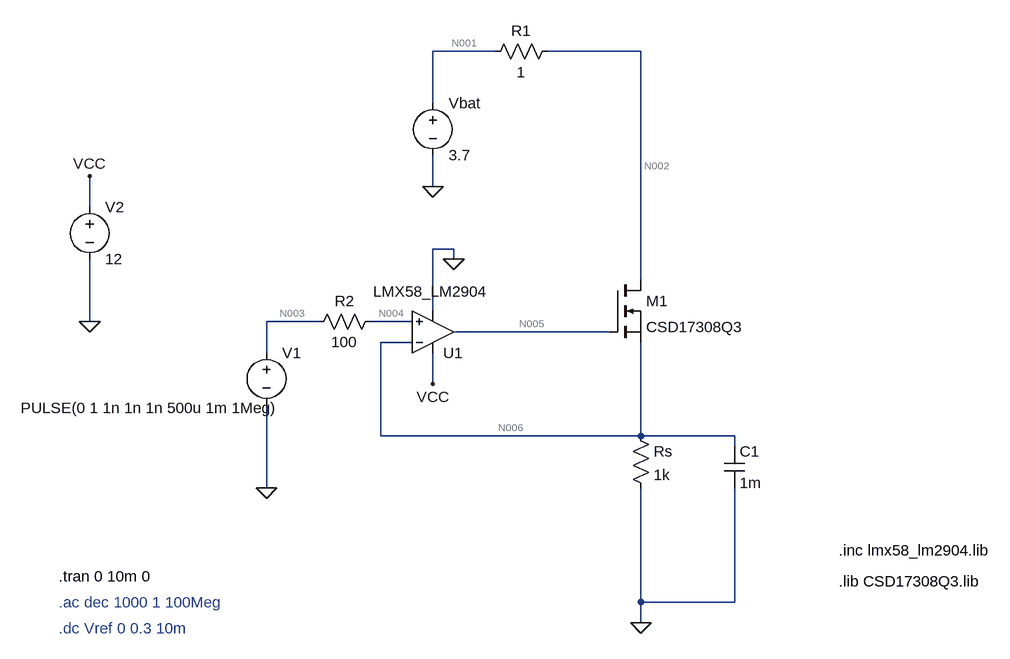
[diagram p0: schematic modulo_descarga_pwm.asc]
modulo_descarga_pwm.asc, the LTspice schematic file:
Version 4.1
SHEET 1 1700 680
WIRE 720 -912 624 -912
WIRE 944 -912 800 -912
WIRE 624 -832 624 -912
WIRE 624 -704 624 -752
WIRE 96 -672 96 -720
WIRE 656 -608 624 -608
WIRE 656 -592 656 -608
WIRE 944 -560 944 -912
WIRE 624 -512 624 -608
WIRE 96 -496 96 -592
WIRE 448 -496 368 -496
WIRE 592 -496 528 -496
WIRE 896 -480 656 -480
WIRE 592 -464 544 -464
WIRE 368 -448 368 -496
WIRE 624 -400 624 -448
WIRE 544 -320 544 -464
WIRE 944 -320 944 -464
WIRE 944 -320 544 -320
WIRE 1088 -320 944 -320
WIRE 1088 -304 1088 -320
WIRE 368 -240 368 -368
WIRE 944 -64 944 -240
WIRE 1088 -64 1088 -240
WIRE 1088 -64 944 -64
WIRE 944 -32 944 -64
FLAG 944 -32 0
FLAG 96 -720 VCC
FLAG 96 -496 0
FLAG 624 -400 VCC
FLAG 368 -240 0
FLAG 624 -704 0
FLAG 656 -592 0
SYMBOL OpAmps\\opamp2 624 -416 M180
WINDOW 3 -92 126 Left 2
SYMATTR Value LMX58_LM2904
SYMATTR InstName U1
SYMBOL voltage 96 -688 R0
WINDOW 123 0 0 Left 0
WINDOW 39 0 0 Left 0
SYMATTR InstName V2
SYMATTR Value 12
SYMBOL res 928 -336 R0
SYMATTR InstName Rs
SYMATTR Value 1k
SYMBOL voltage 624 -848 R0
WINDOW 123 0 0 Left 0
WINDOW 39 0 0 Left 0
SYMATTR InstName Vbat
SYMATTR Value 3.7
SYMBOL res 816 -928 R90
WINDOW 0 0 56 VBottom 2
WINDOW 3 32 56 VTop 2
SYMATTR InstName R1
SYMATTR Value 1
SYMBOL res 544 -512 R90
WINDOW 0 0 56 VBottom 2
WINDOW 3 32 56 VTop 2
SYMATTR InstName R2
SYMATTR Value 100
SYMBOL nmos 896 -560 R0
SYMATTR InstName M1
SYMATTR Value CSD17308Q3
SYMATTR Prefix x
SYMBOL voltage 368 -464 R0
WINDOW 3 -378 101 Left 2
WINDOW 123 0 0 Left 0
WINDOW 39 0 0 Left 0
SYMATTR InstName V1
SYMATTR Value PULSE(0 1 1n 1n 1n 500u 1m 1Meg)
SYMBOL cap 1072 -304 R0
SYMATTR InstName C1
SYMATTR Value 1m
TEXT 1248 -144 Left 2 !.inc lmx58_lm2904.lib
TEXT 48 -104 Left 2 !.tran 0 10m 0
TEXT 48 -64 Left 2 ;.ac dec 1000 1 100Meg
TEXT 1248 -96 Left 2 !.lib CSD17308Q3.lib
TEXT 48 -24 Left 2 ;.dc Vref 0 0.3 10m

The netlist it stands for:
* modulo_descarga_pwm.asc
X§U1 N004 N006 VCC 0 N005 LMX58_LM2904  ; pins In+ In- V+ V- OUT
V2 VCC 0 12
Rs N006 0 1k
Vbat N001 0 3.7
R1 N002 N001 1
R2 N004 N003 100
X§M1 N002 N005 N006 CSD17308Q3  ; pins D G S
V1 N003 0 PULSE(0 1 1n 1n 1n 500u 1m 1Meg)
C1 N006 0 1m
.inc lmx58_lm2904.lib
.tran 0 10m 0
* .ac dec 1000 1 100Meg
.lib CSD17308Q3.lib
* .dc Vref 0 0.3 10m
.backanno
.end

* Results of the author's LTspice run, read from the files saved beside the schematic
* Operating Point, zero values left out:
*   V(n006) = 2.162 mV
*   V(n005) = 970.5 mV
*   V(n001) = 3.7 V
*   V(n004) = 2.001 µV
*   V(vcc) = 12 V
*   V(n002) = 3.7 V
*   I(R2) = 20.01 nA
*   I(Rs) = 2.162 µA
*   I(Vbat) = -2.144 µA
*   I(V1) = 20.01 nA
*   I(V2) = -350 µA
*   I(R1) = -2.144 µA
*   Ix(m1:1) = 2.144 µA
*   Ix(m1:2) = -2.665 pA
*   Ix(m1:3) = -2.144 µA
*   Ix(u1:in+) = -20.01 nA
*   Ix(u1:in-) = -18.01 nA
*   Ix(u1:vcc) = 350 µA
*   Ix(u1:vee) = -350 µA
*   Ix(u1:out) = 2.619 pA
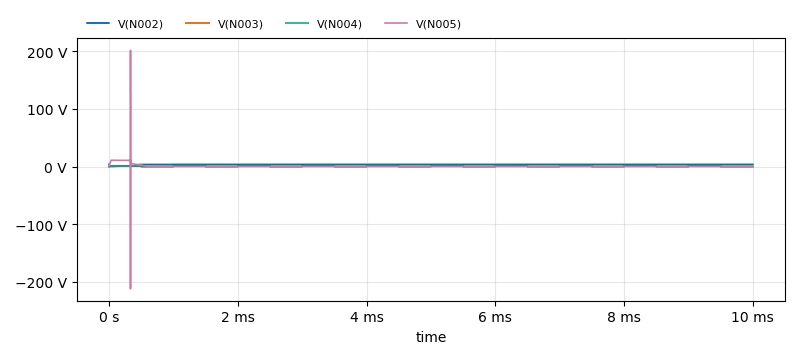
[diagram p1: Transient Analysis of modulo_descarga_pwm.asc, plotted from the saved traces]
* Transient Analysis, 1 run:
*   V(N002): min 64.06 mV, max 3.7 V, average 3.566 V, rms 3.619 V, last 3.7 V
*   V(N003): min 0 V, max 1 V, average 500 mV, rms 707.1 mV, last 0 V
*   V(N004): min -201.9 mV, max 1.202 V, average 500 mV, rms 707.1 mV, last 2.003 µV
*   V(N005): min -212.5 V, max 201.9 V, average 448.8 mV, rms 1.997 V, last 23.79 mV